# Altium schematic sheet AFR_Bar_Termination_Resistors.SchDoc
size A
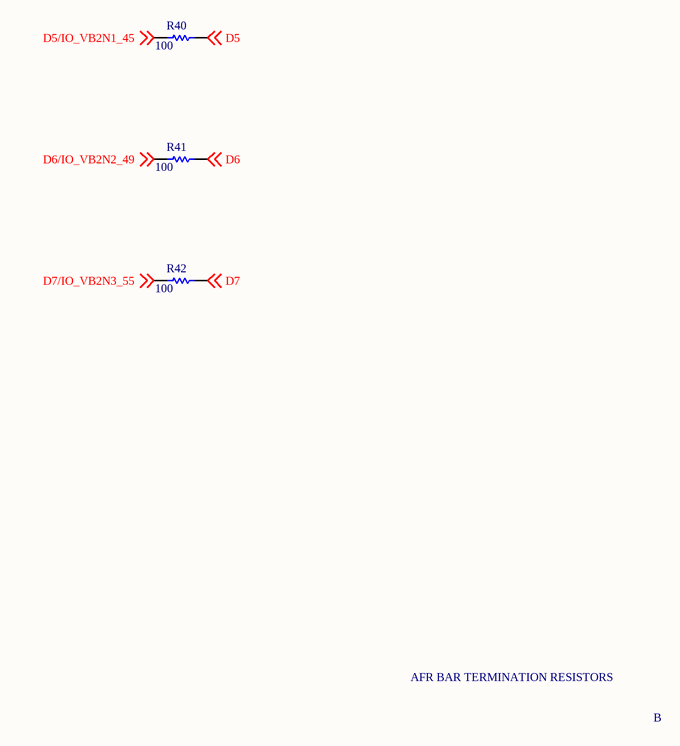
[diagram p0: AFR_Bar_Termination_Resistors.SchDoc]

## Parts
R40  value 100  [RES_0603]  (hidden comment: Figure out ohmage after RevA)
R41  value 100  [RES_0603]  (hidden comment: Figure out ohmage after RevA)
R42  value 100  [RES_0603]  (hidden comment: Figure out ohmage after RevA)

## Nets
D5: R40.2 ; off-sheet D5
D5/IO_VB2N1_45: R40.1 ; off-sheet D5/IO_VB2N1_45
D6: R41.2 ; off-sheet D6
D6/IO_VB2N2_49: R41.1 ; off-sheet D6/IO_VB2N2_49
D7: R42.2 ; off-sheet D7
D7/IO_VB2N3_55: R42.1 ; off-sheet D7/IO_VB2N3_55

## Notes on the sheet
- AFR BAR TERMINATION RESISTORS
- B

## Library data of the parts
R40-R42 = Res1: Resistor; Published: 8-Jun-2000; LatestRevisionDate: 17-Jul-2002; LatestRevisionNote: Re-released for DXP Platform.; PackageReference: AXIAL-0.3; Publisher: Altium Limited; PackageDescription: Axial Device, Thru-Hole; 2 Leads; 0.3 in Pin Spacing